# Altium schematic sheet ESC.SchDoc
size A
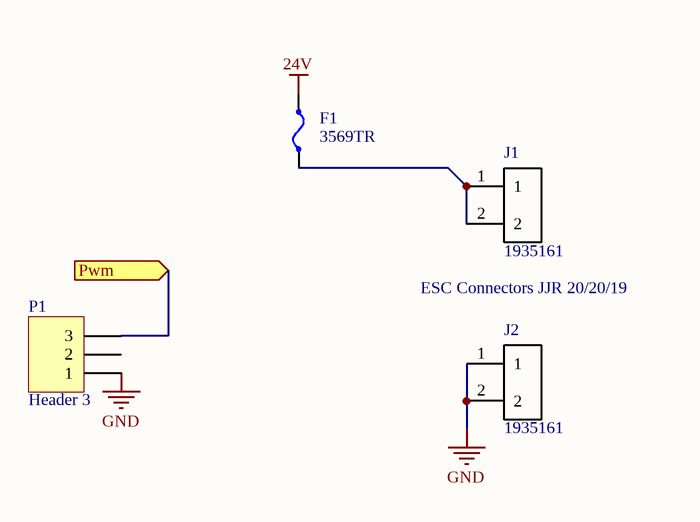
[diagram p0: ESC.SchDoc]

## Parts
F1  3569TR  [Horizontal SMD fuse clip]
J1  1935161  [PHOENIX_1935161]
J2  1935161  [PHOENIX_1935161]
P1  Header 3  [HDR1X3]

## Ports
Pwm (in)

## Nets
24V: F1.1
GND: J2.1 J2.2 P1.1
Pwm: P1.3 ; port Pwm
NetF1_2: F1.2 J1.1 J1.2

Not connected (* = marked no-connect by the designer): P1 2

## Notes on the sheet
- ESC Connectors JJR 20/20/19

## Library data of the parts
F1 = 3569TR: Fuse Clip Assembly; Manufacturer 1: KEYSTONE; Subassembly: Yes; Description 1: KEYSTONE - 3569TR - FUSE CLIP, AUTO BLADE, SMT; Supplier 1: Newark; Supplier Part Number 1: 24T5056; RoHS: YES; Stock 1: 1000; Pricing 1: 1=0.798, 50=0.672, 100=0.644, 250=0.589, 500=0.566, 1000=0.491, 2500=0.427, 5000=0.413 (USD); ComponentLink1URL: http://www.farnell.com/datasheets/1703973.pdf; ComponentLink1Description: http://www.farnell.com/datasheets/1703973.pdf; Manufacturer Part Number: 3569TR
J1 J2 = 1935161: Conn Terminal Blocks 2 POS 5mm Solder ST Thru-Hole 16A; MF: Phoenix Contact; Package: None; MP: 1935161; SnapEDA_Link: https://www.snapeda.com/parts/1935161/Phoenix%20Contact/view-part/?ref=snap; Availability: Unavailable; Price: None; Value: *
P1 = Header 3: Header, 3-Pin; LatestRevisionDate: 17-Jul-2002; LatestRevisionNote: Re-released for DXP Platform.; Publisher: Altium Limited